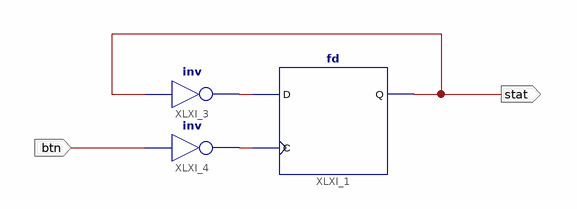
[diagram p0: schematic sheet 1]
// Xilinx ISE schematic pause.sch (spartan3e) as structural Verilog: 3 symbols, 2 ports
module pause (
  input  btn,
  output stat
);

  wire XLXN_1, XLXN_2;

  fd XLXI_1 (.C(XLXN_2), .D(XLXN_1), .Q(stat));
  not XLXI_3 (XLXN_1, stat);
  not XLXI_4 (XLXN_2, btn);
endmodule
